# EAGLE design GPIO pins (EAGLE 7.6.0)
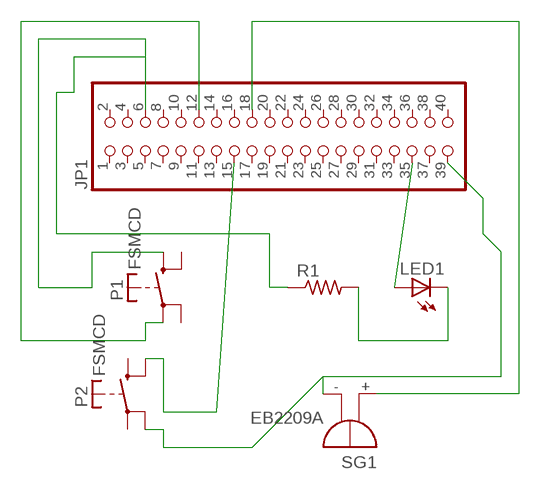
[diagram p0: schematic, sheet 1]

## Parts
JP1  PINHD-2X20  [2X20]
LED1  LED5MM  [LED5MM]
P1  FSMCD  [FSMCD]
P2  FSMCD  [FSMCD]
R1  R-US_0207/5V  [0207/5V]
SG1  EB2209A  [EB2209A]

## Nets
N$1: JP1.35 LED1.A
N$2: LED1.K(C) R1.2
N$3: JP1.18 SG1.+
N$5: JP1.12 P1.P$1(P)
N$6: JP1.15 P2.P$4(S)
N$7: JP1.39 P2.P$2(P) SG1.-
N$8: JP1.6 P1.P$3(S) R1.1
Unconnected: JP1.1 JP1.2 JP1.3 JP1.4 JP1.5 JP1.7 JP1.8 JP1.9 JP1.10 JP1.11 JP1.13 JP1.14 JP1.16 JP1.17 JP1.19 JP1.20 JP1.21 JP1.22 JP1.23 JP1.24 JP1.25 JP1.26 JP1.27 JP1.28 JP1.29 JP1.30 JP1.31 JP1.32 JP1.33 JP1.34 JP1.36 JP1.37 JP1.38 JP1.40 P1.P$2(P) P1.P$4(S) P2.P$1(P) P2.P$3(S)

## Library data of the parts
JP1 = adafruit:PINHD-2X20: PIN HEADER
LED1 = adafruit:LED: LED OSRAM: - CHIPLED LG R971, LG N971, LY N971, LG Q971, LY Q971, LO R971, LY R971 LH N974, LH R974 LS Q976, LO Q976, LY Q976 LO Q996 - Hyper CHIPLED LW Q18S LB Q993, LB Q99A, LB R99A - SideLED LS A670, LO A670, LY A670, LG A670, LP A670 LB A673, LV A673, LT A673, LW A673 LH A674 LY A675 LS A676, LA A676, LO A676, LY A676, LW A676 LS A679, LY A679, LG A679 - Hyper Micro SIDELED® LS Y876, LA Y876, LO Y876, LY Y876 LT Y87S - SmartLED LW L88C, LW L88S LB L89C, LB L89S, LG L890 LS L89K, LO L89K, LY L89K LS L896, LA L896, LO L896, LY L896 - TOPLED LS T670, LO T670, LY T670, LG T670, LP T670 LSG T670, LSP T670, LSY T670, LOP T670, LYG T670 LG T671, LOG T671, LSG T671 LB T673, LV T673, LT T673, LW T673 LH T674 LS T676, LA T676, LO T676, LY T676, LB T676, LH T676, LSB T676, LW T676 LB T67C, LV T67C, LT T67C, LS T67K, LO T67K, LY T67K, LW E67C LS E67B, LA E67B, LO E67B, LY E67B, LB E67C, LV E67C, LT E67C LW T67C LS T679, LY T679, LG T679 LS T770, LO T770, LY T770, LG T770, LP T770 LB T773, LV T773, LT T773, LW T773 LH T774 LS E675, LA E675, LY E675, LS T675 LS T776, LA T776, LO T776, LY T776, LB T776 LHGB T686 LT T68C, LB T68C - Hyper Mini TOPLED® LB M676 - Mini TOPLED Santana® LG M470 LS M47K, LO M47K, LY M47K Source: http://www.osram.convergy.de/
P1 P2 = switch-misc:FSMCD: TYCO SWITCH
R1 = adafruit:R-US_: RESISTOR, American symbol
SG1 = buzzer:EB2209A: BUZZER Source: Buerklin; OC_FARNELL: unknown; OC_NEWARK: unknown

## Board
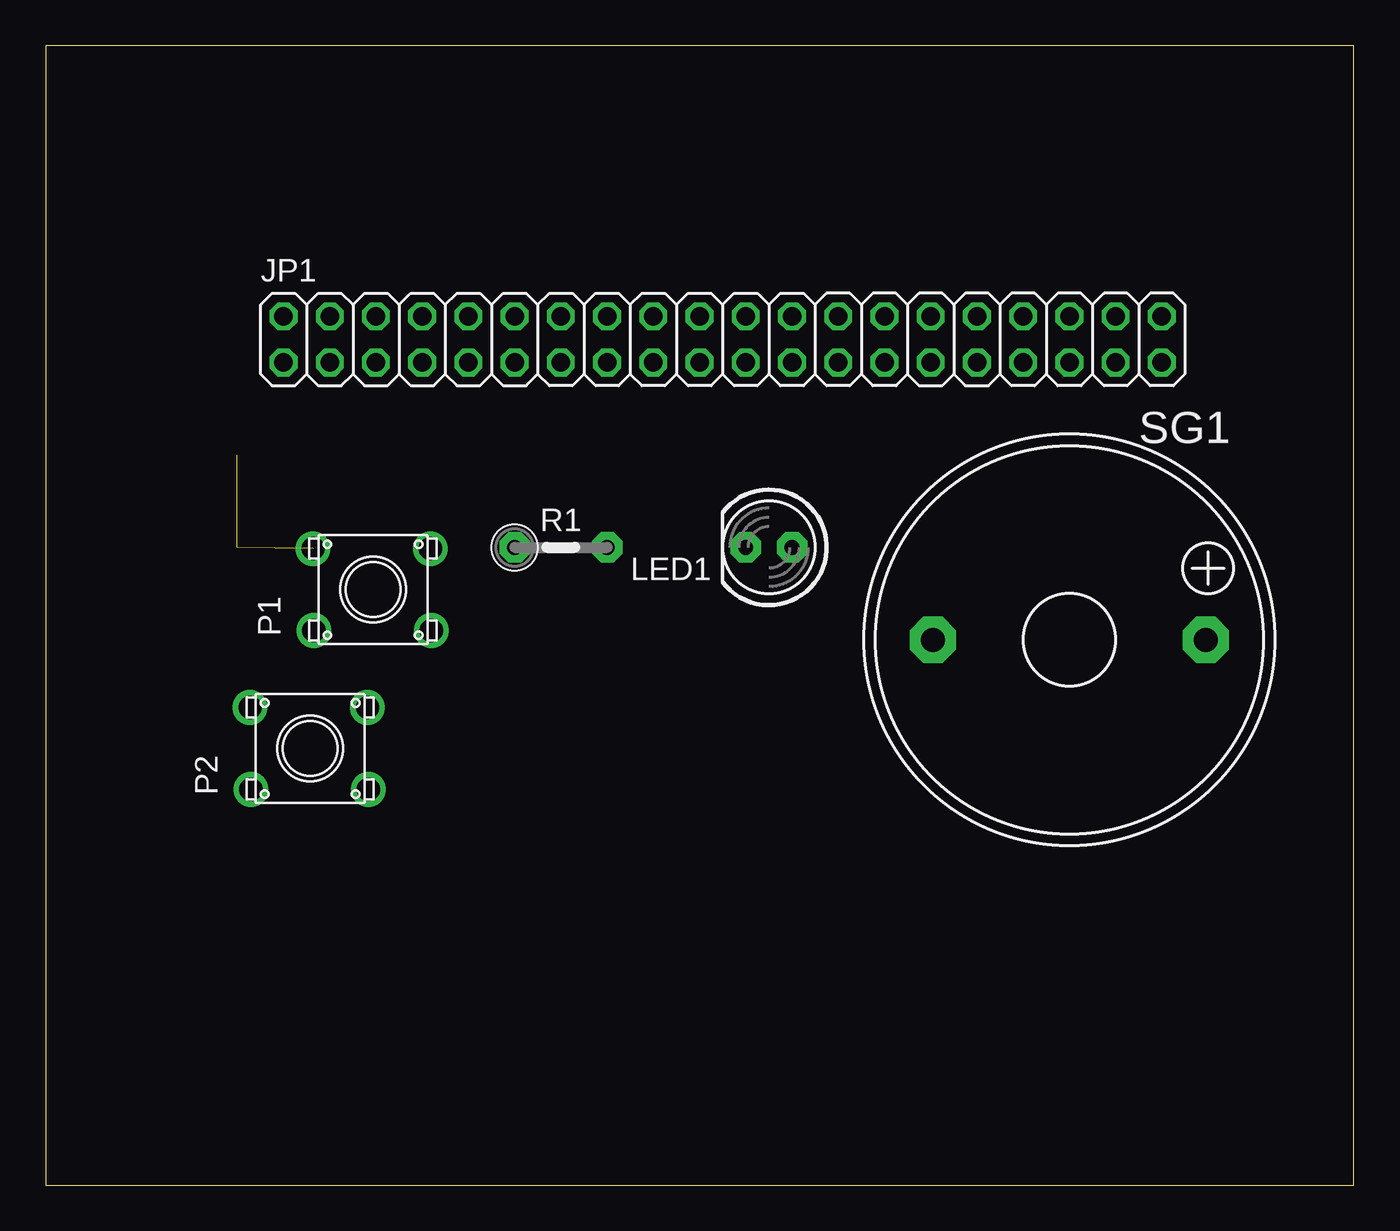
[diagram p1: board, top side]
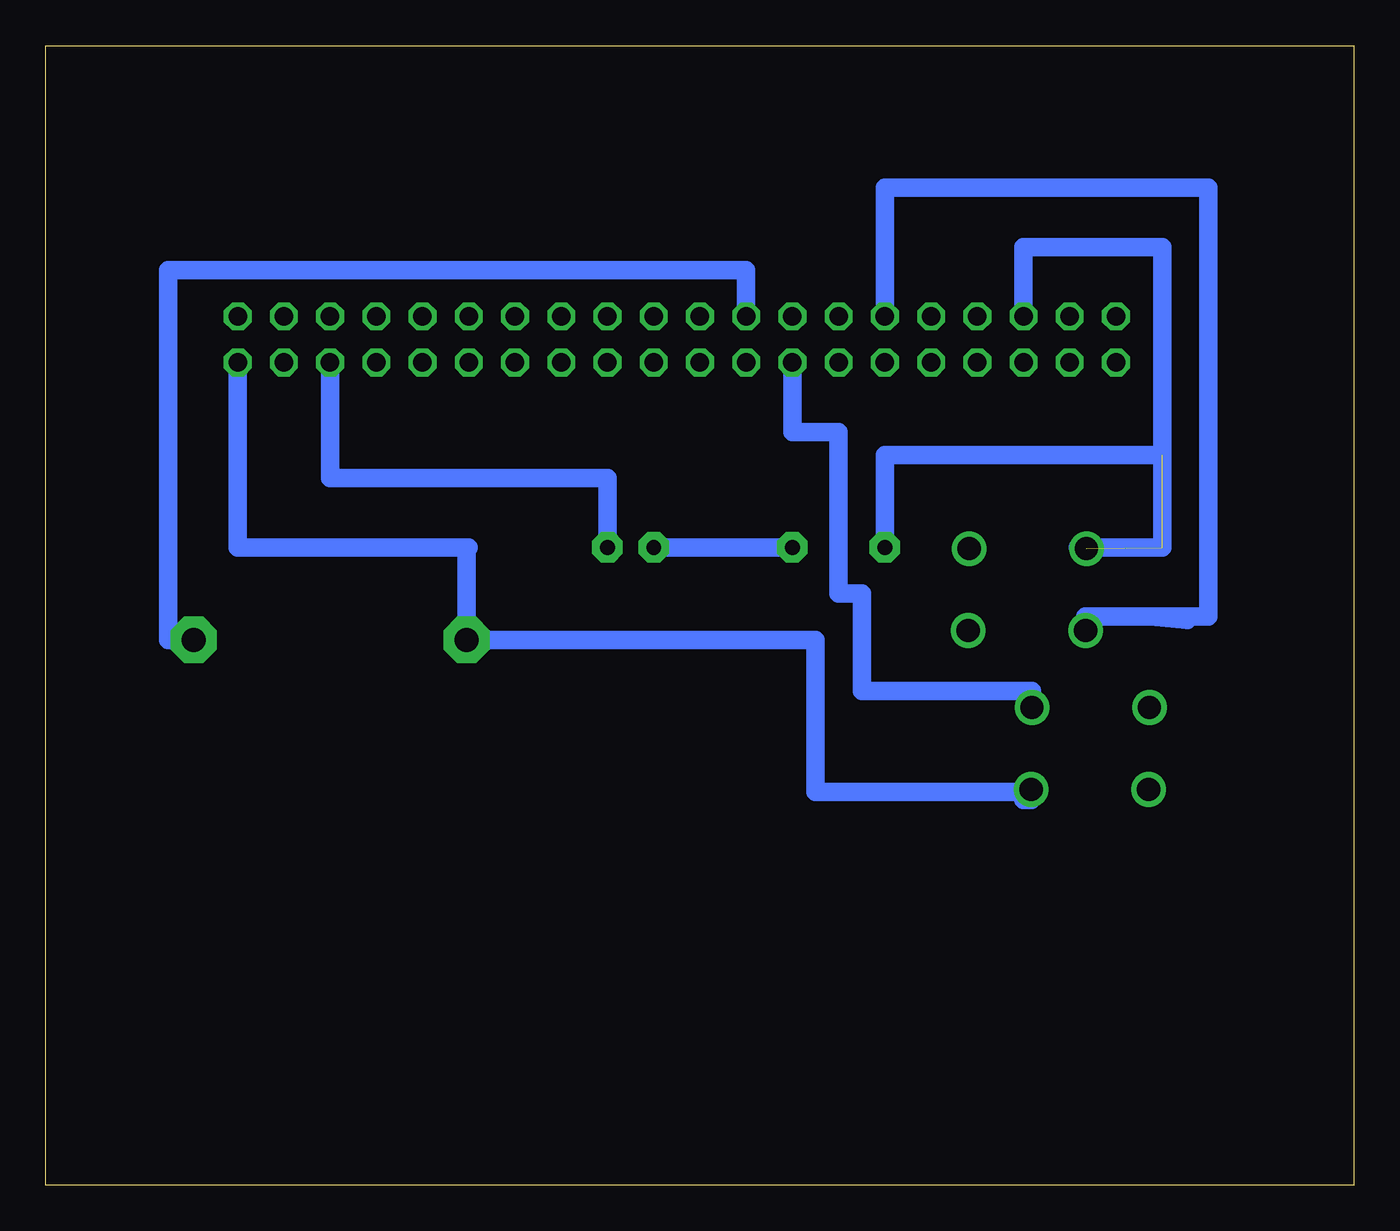
[diagram p2: board, bottom side, seen from below]

Size 71.9 x 62.63 mm. Coordinates in mm from the lower left corner, seen from the top.
Outline: 0,0 71.9,0 71.9,62.63 0,62.63 0,0
Copper layers (1*16): Top 0.035mm / dielectric 1.5mm / Bottom 0.035mm
Design rules "default": minimum track width 10mil, minimum drill 24mil, track to track 8mil, track to pad 8mil, pad to pad 8mil, via to via 8mil, smd to smd 8mil, copper to edge 40mil, drill to drill 8mil, minimum pad ring 10mil, minimum via ring 8mil, stop-mask expansion 4mil, vias tented up to drill 0mil, thermal gap 10mil

### Footprints (pad centres in the part's own frame; a part is rotated, then mirrored left to right if it is on the bottom)
2X20 = drill 1.016 octagon: 1 -24.13,-1.27; 2 -24.13,1.27; 3 -21.59,-1.27; 4 -21.59,1.27; 5 -19.05,-1.27; 6 -19.05,1.27; 7 -16.51,-1.27; 8 -16.51,1.27; 9 -13.97,-1.27; 10 -13.97,1.27; 11 -11.43,-1.27; 12 -11.43,1.27; 13 -8.89,-1.27; 14 -8.89,1.27; 15 -6.35,-1.27; 16 -6.35,1.27; 17 -3.81,-1.27; 18 -3.81,1.27; 19 -1.27,-1.27; 20 -1.27,1.27; 21 1.27,-1.27; 22 1.27,1.27; 23 3.81,-1.27; 24 3.81,1.27; 25 6.35,-1.27; 26 6.35,1.27; 27 8.89,-1.27; 28 8.89,1.27; 29 11.43,-1.27; 30 11.43,1.27; 31 13.97,-1.27; 32 13.97,1.27; 33 16.51,-1.27; 34 16.51,1.27; 35 19.05,-1.27; 36 19.05,1.27; 37 21.59,-1.27; 38 21.59,1.27; 39 24.13,-1.27; 40 24.13,1.27
LED5MM = drill 0.813 pad 1.676 octagon: A -1.27,0; K 1.27,0
FSMCD = drill 1.27: P$1 -2.25,3.25; P$2 -2.25,-3.2; P$3 2.25,3.3; P$4 2.25,-3.15
0207/5V = drill 0.813 pad 1.676 octagon: 1 -2.54,0; 2 2.54,0
EB2209A = drill 1.321 pad 2.54 octagon: + 7.493,0; - -7.493,0

### Placement (x,y rotation side)
JP1  37.21,46.48 0 top
LED1  39.75,35.05 180 top
P1  18,32.73 90 top
P2  14.54,24 90 top
R1  28.32,35.05 0 top
SG1  56.26,29.97 0 top

### Tracks (layer width: path | path; a pad name or v marks a point on that pad's centre or on a via)
N$1
  Bottom 1.016: JP1.35 56.26,38.86 41.02,38.86 LED1.A
N$2
  Bottom 1.016: R1.2 LED1.K
N$3
  Bottom 1.016: JP1.18 33.4,50.29 65.15,50.29 65.15,29.97 SG1.+
N$5
  Bottom 1.016: JP1.12 25.78,54.83 8,54.83 8,31.24 11.16,31.24 | 11.16,31.24 9.16,31.05 | 11.16,31.24 14.75,31.24 P1.P$1
N$6
  Bottom 1.016: JP1.15 30.86,41.4 28.32,41.4 28.32,32.51 27.05,32.51 27.05,27.16 17.69,27.16 P2.P$4
N$7
  Bottom 1.016: JP1.39 61.34,35.05 48.77,35.05 | 48.64,35.05 48.77,35.05 | 48.77,35.05 SG1.- 29.59,29.97 29.59,21.62 18.16,21.62 18.16,21.16 17.74,21.16 P2.P$2
N$8  (2 unrouted)
  Bottom 1.016: JP1.6 18.16,51.56 10.54,51.56 10.54,35.05 15.16,35.05 | R1.1 25.78,40.13 10.54,40.13